# EAGLE design dist_board (EAGLE 9.0.1)
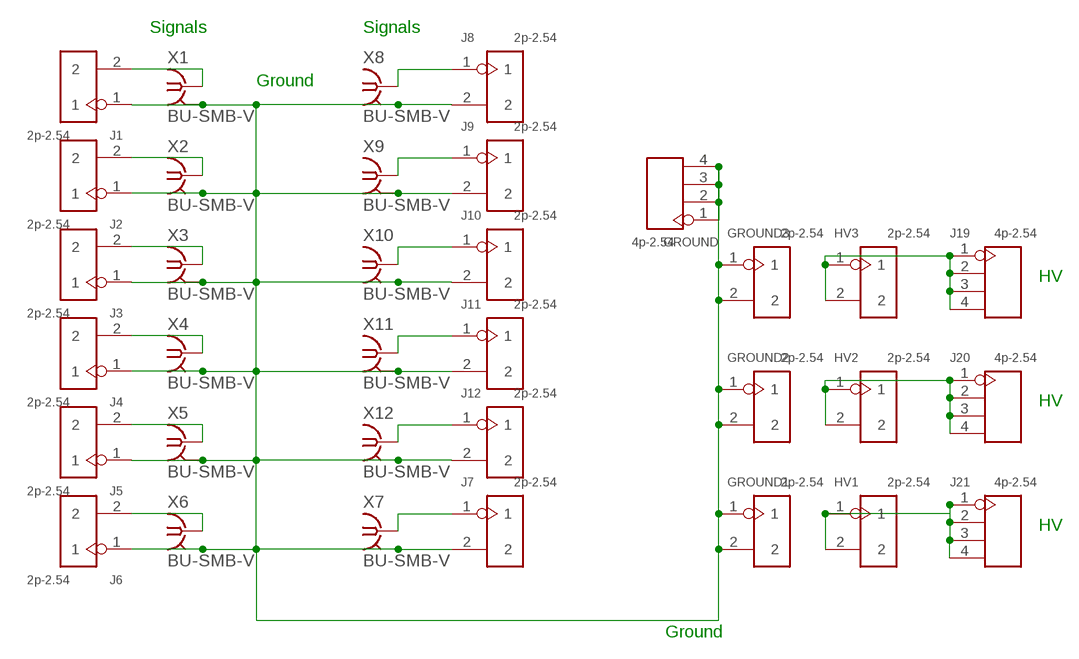
[diagram p0: schematic, sheet 1]

## Parts
GROUND  4p-2.54  DIP-BLACK-FEMALE-HEADER-VERT(4P-2.54)  [H4-2.54]
GROUND1  2p-2.54  DIP-BLACK-MALE-HEADER-VERT(2P-2.54)  [H2-2.54]
GROUND2  2p-2.54  DIP-BLACK-MALE-HEADER-VERT(2P-2.54)  [H2-2.54]
GROUND3  2p-2.54  DIP-BLACK-MALE-HEADER-VERT(2P-2.54)  [H2-2.54]
HV1  2p-2.54  DIP-BLACK-MALE-HEADER-VERT(2P-2.54)  [H2-2.54]
HV2  2p-2.54  DIP-BLACK-MALE-HEADER-VERT(2P-2.54)  [H2-2.54]
HV3  2p-2.54  DIP-BLACK-MALE-HEADER-VERT(2P-2.54)  [H2-2.54]
J1  2p-2.54  DIP-BLACK-MALE-HEADER-VERT(2P-2.54)  [H2-2.54]
J2  2p-2.54  DIP-BLACK-MALE-HEADER-VERT(2P-2.54)  [H2-2.54]
J3  2p-2.54  DIP-BLACK-MALE-HEADER-VERT(2P-2.54)  [H2-2.54]
J4  2p-2.54  DIP-BLACK-MALE-HEADER-VERT(2P-2.54)  [H2-2.54]
J5  2p-2.54  DIP-BLACK-MALE-HEADER-VERT(2P-2.54)  [H2-2.54]
J6  2p-2.54  DIP-BLACK-MALE-HEADER-VERT(2P-2.54)  [H2-2.54]
J7  2p-2.54  DIP-BLACK-MALE-HEADER-VERT(2P-2.54)  [H2-2.54]
J8  2p-2.54  DIP-BLACK-MALE-HEADER-VERT(2P-2.54)  [H2-2.54]
J9  2p-2.54  DIP-BLACK-MALE-HEADER-VERT(2P-2.54)  [H2-2.54]
J10  2p-2.54  DIP-BLACK-MALE-HEADER-VERT(2P-2.54)  [H2-2.54]
J11  2p-2.54  DIP-BLACK-MALE-HEADER-VERT(2P-2.54)  [H2-2.54]
J12  2p-2.54  DIP-BLACK-MALE-HEADER-VERT(2P-2.54)  [H2-2.54]
J19  4p-2.54  DIP-BLACK-FEMALE-HEADER-VERT(4P-2.54)  [H4-2.54]
J20  4p-2.54  DIP-BLACK-FEMALE-HEADER-VERT(4P-2.54)  [H4-2.54]
J21  4p-2.54  DIP-BLACK-FEMALE-HEADER-VERT(4P-2.54)  [H4-2.54]
X1  BU-SMB-V  [BU-SMB-V]
X2  BU-SMB-V  [BU-SMB-V]
X3  BU-SMB-V  [BU-SMB-V]
X4  BU-SMB-V  [BU-SMB-V]
X5  BU-SMB-V  [BU-SMB-V]
X6  BU-SMB-V  [BU-SMB-V]
X7  BU-SMB-V  [BU-SMB-V]
X8  BU-SMB-V  [BU-SMB-V]
X9  BU-SMB-V  [BU-SMB-V]
X10  BU-SMB-V  [BU-SMB-V]
X11  BU-SMB-V  [BU-SMB-V]
X12  BU-SMB-V  [BU-SMB-V]

## Nets
GND: GROUND1.1 GROUND1.2 GROUND2.1 GROUND2.2 GROUND3.1 GROUND3.2 GROUND.1 GROUND.2 GROUND.3 GROUND.4 J1.1 J2.1 J3.1 J4.1 J5.1 J6.1 J7.2 J8.2 J9.2 J10.2 J11.2 J12.2 X1.2 X1.3 X1.4 X1.5 X2.2 X2.3 X2.4 X2.5 X3.2 X3.3 X3.4 X3.5 X4.2 X4.3 X4.4 X4.5 X5.2 X5.3 X5.4 X5.5 X6.2 X6.3 X6.4 X6.5 X7.2 X7.3 X7.4 X7.5 X8.2 X8.3 X8.4 X8.5 X9.2 X9.3 X9.4 X9.5 X10.2 X10.3 X10.4 X10.5 X11.2 X11.3 X11.4 X11.5 X12.2 X12.3 X12.4 X12.5
N$1: J1.2 X1.1
N$2: HV2.1 HV2.2 J20.1 J20.2 J20.3 J20.4
N$3: J6.2 X6.1
N$4: J5.2 X5.1
N$5: J4.2 X4.1
N$6: J3.2 X3.1
N$7: J2.2 X2.1
N$8: J8.1 X8.1
N$9: J9.1 X9.1
N$10: J10.1 X10.1
N$11: J11.1 X11.1
N$12: J12.1 X12.1
N$13: J7.1 X7.1
N$14: HV1.1 HV1.2 J21.1 J21.2 J21.3 J21.4
N$18: HV3.1 HV3.2 J19.1 J19.2 J19.3 J19.4

## Notes on the sheet
- Signals | Signals
- Ground
- HV
- HV
- HV
- Ground

## Library data of the parts
GROUND J19-J21 = Seeed-Connector:DIP-BLACK-FEMALE-HEADER-VERT(4P-2.54): 320030017; MPN: F185-1104A1BSYA1
GROUND1-GROUND3 HV1-HV3 J1-J12 = Seeed-Connector:DIP-BLACK-MALE-HEADER-VERT(2P-2.54): 320020016; MPN: P125-1102A0BS116A1
X1-X12 = con-coax:BU-SMB-V: FEMALE SMB CONNECTOR Radiall distributor RS 112-2993; OC_FARNELL: unknown; OC_NEWARK: unknown

## Board
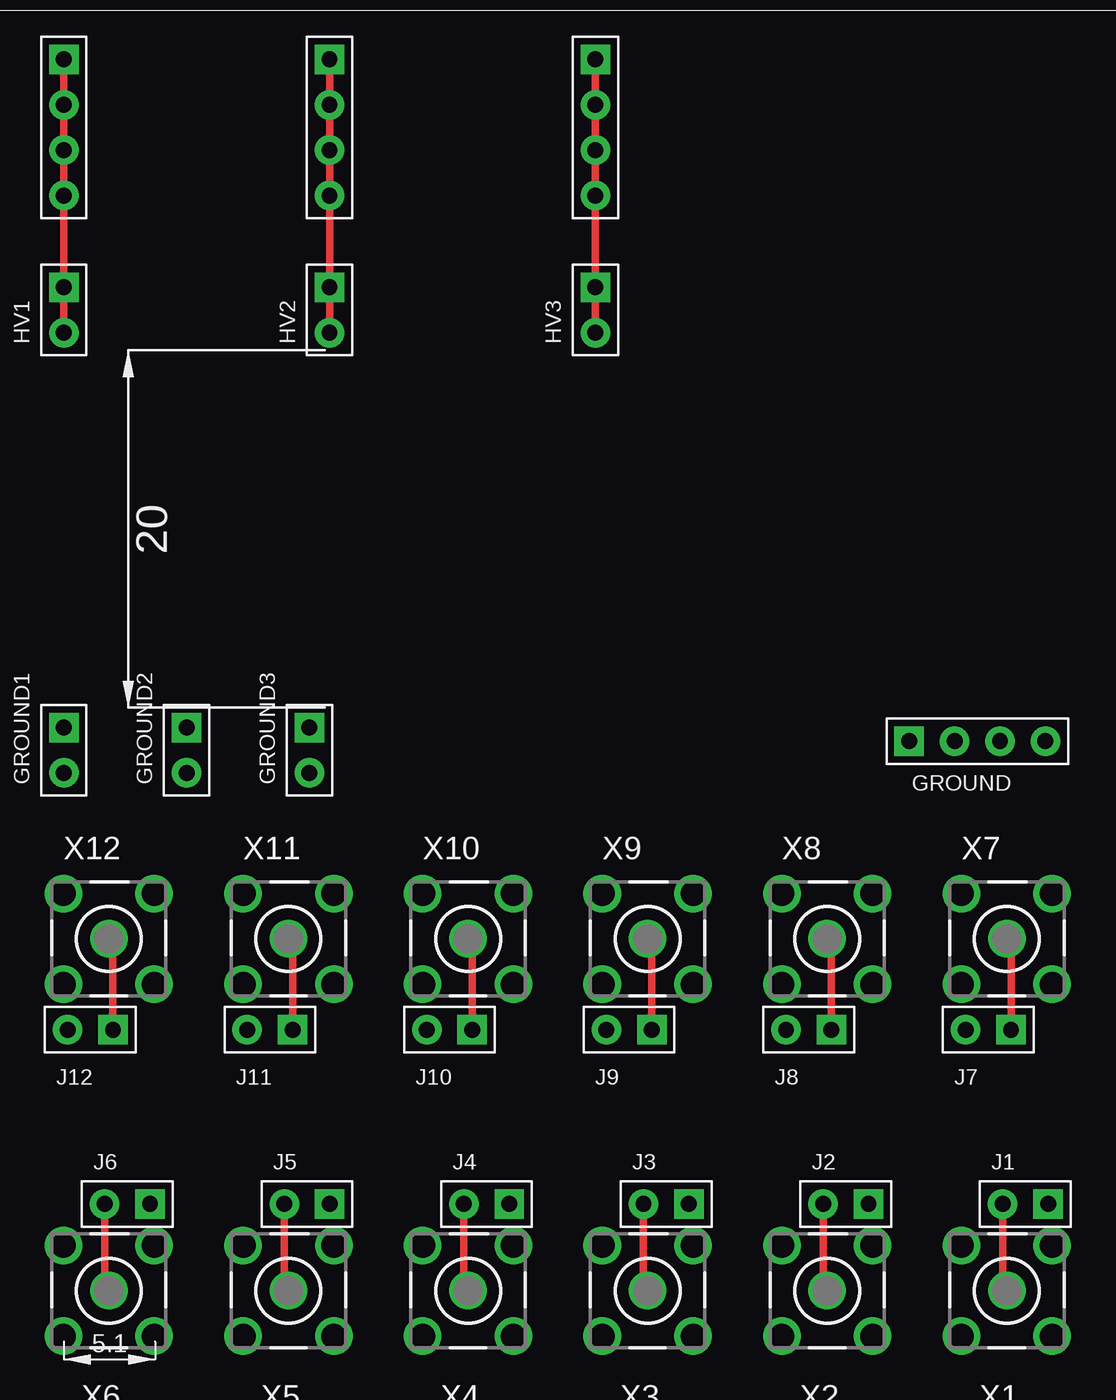
[diagram p1: board, top side]
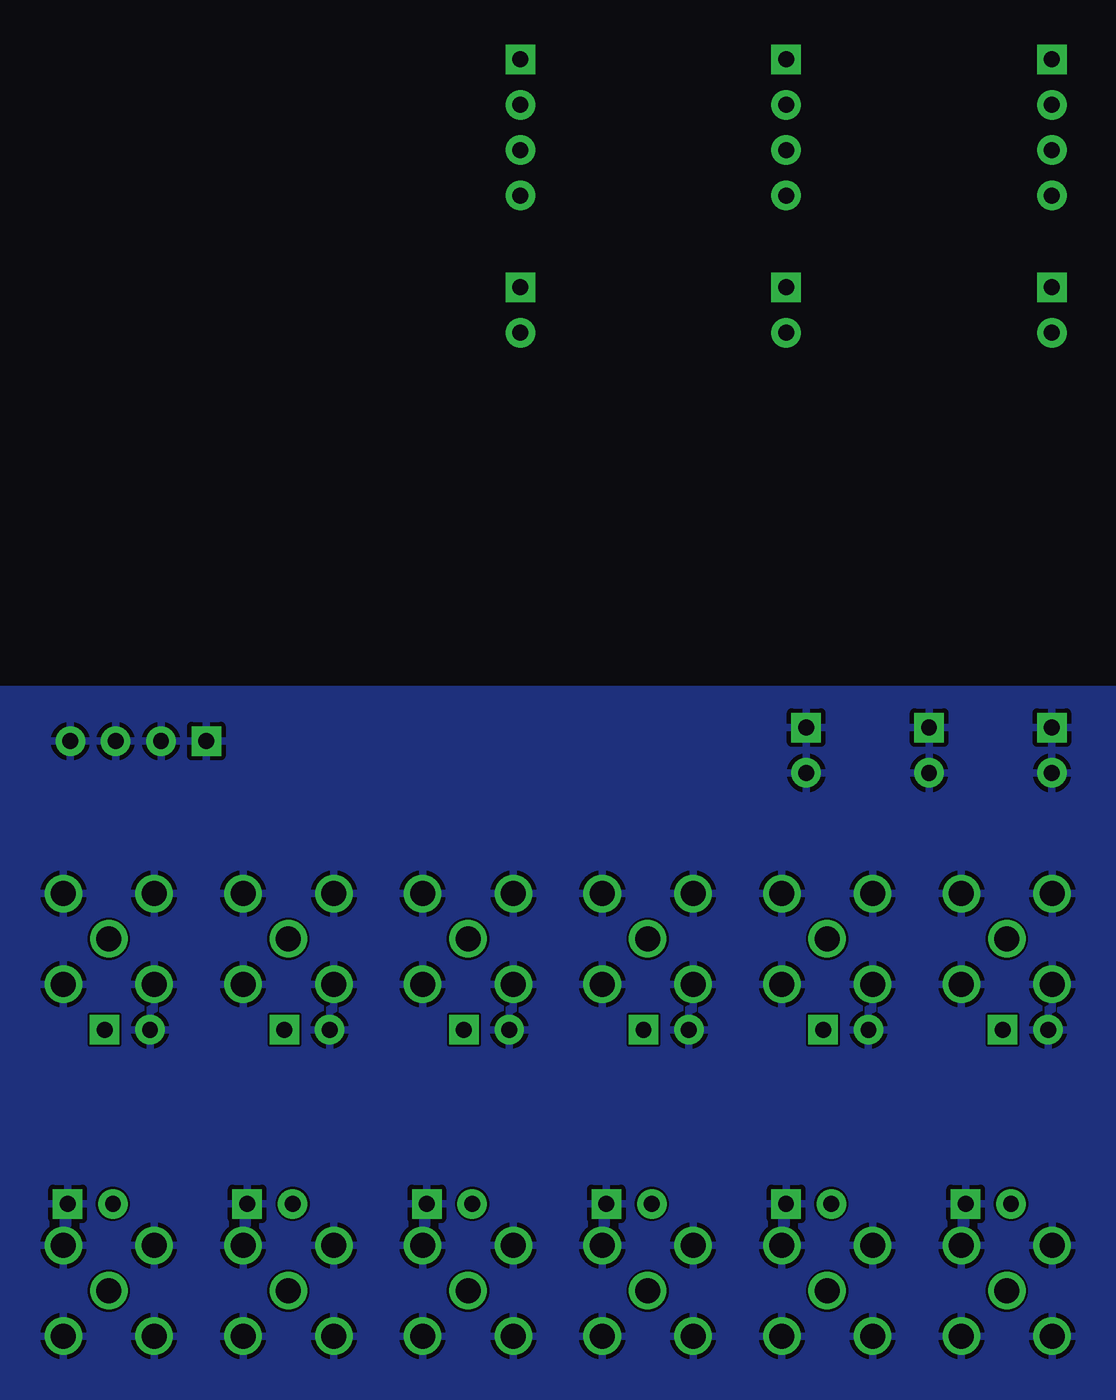
[diagram p2: board, bottom side, seen from below]

No outline drawn. Coordinates in mm, seen from the top.
Copper layers (1*16): Top 0.035mm / dielectric 1.5mm / Bottom 0.035mm
Design rules "MF_Standard_2_Layer": minimum track width 5mil, minimum drill 12mil, track to track 5mil, track to pad 5mil, pad to pad 5mil, via to via 5mil, smd to smd 0mil, copper to edge 10mil, drill to drill 10mil, minimum pad ring 6mil, minimum via ring 6mil, stop-mask expansion 2mil, vias tented up to drill 25mil, thermal gap 10mil

### Footprints (pad centres in the part's own frame; a part is rotated, then mirrored left to right if it is on the bottom)
H4-2.54 = drill 0.889 pad 1.651 square: 1 0,3.81 | drill 0.889 pad 1.651: 2 0,1.27; 3 0,-1.27; 4 0,-3.81
H2-2.54 = drill 0.889 pad 1.651 square: 1 0,1.27 | drill 0.889 pad 1.651: 2 0,-1.27
BU-SMB-V = drill 1.4: 1 0,0; 2 -2.54,2.54; 3 2.54,2.54; 4 2.54,-2.54; 5 -2.54,-2.54

### Placement (x,y rotation side)
GROUND  59.52,39.12 90 top
GROUND1  8.39,38.61 0 top
GROUND2  15.27,38.61 0 top
GROUND3  22.14,38.61 0 top
HV1  8.39,63.26 0 top
HV2  23.27,63.26 0 top
HV3  38.14,63.26 0 top
J1  62.21,13.21 270 top
J2  52.16,13.21 270 top
J3  42.11,13.21 270 top
J4  32.05,13.21 270 top
J5  22,13.21 270 top
J6  11.95,13.21 270 top
J7  60.14,22.96 270 top
J8  50.08,22.96 270 top
J9  40.03,22.96 270 top
J10  29.98,22.96 270 top
J11  19.93,22.96 270 top
J12  9.87,22.96 270 top
J19  38.14,73.48 0 top
J20  23.27,73.48 0 top
J21  8.39,73.48 0 top
X1  61.17,8.35 0 top
X2  51.12,8.35 0 top
X3  41.07,8.35 0 top
X4  31.02,8.35 0 top
X5  20.96,8.35 0 top
X6  10.91,8.35 0 top
X7  61.17,28.05 0 top
X8  51.12,28.05 0 top
X9  41.07,28.05 0 top
X10  31.02,28.05 0 top
X11  20.96,28.05 0 top
X12  10.91,28.05 0 top

### Tracks (layer width: path | path; a pad name or v marks a point on that pad's centre or on a via)
GND
  pour Bottom: 4,42 74,42 74,1 3,1 3,42
N$1
  Top 0.406: J1.2 60.94,8.58 X1.1
N$2
  Top 0.406: J20.1 J20.2 J20.3 J20.4 HV2.1 HV2.2
N$3
  Top 0.406: X6.1 10.68,8.57 J6.2
N$4
  Top 0.406: J5.2 20.73,8.58 X5.1
N$5
  Top 0.406: J4.2 30.78,8.58 X4.1
N$6
  Top 0.406: J3.2 40.84,8.58 X3.1
N$7
  Top 0.406: J2.2 50.89,8.58 X2.1
N$8
  Top 0.406: X8.1 51.35,27.82 J8.1
N$9
  Top 0.406: J9.1 41.3,27.82 X9.1
N$10
  Top 0.406: J10.1 31.25,27.82 X10.1
N$11
  Top 0.406: J11.1 21.2,27.82 X11.1
N$12
  Top 0.406: J12.1 11.14,27.82 X12.1
N$13
  Top 0.406: J7.1 61.41,27.82 X7.1
N$14
  Top 0.406: HV1.2 HV1.1 J21.4 J21.3 J21.2 J21.1
N$18
  Top 0.406: J19.1 J19.2 J19.3 J19.4 HV3.1 HV3.2